# EAGLE design Analog_Schematic (EAGLE 9.5.2)
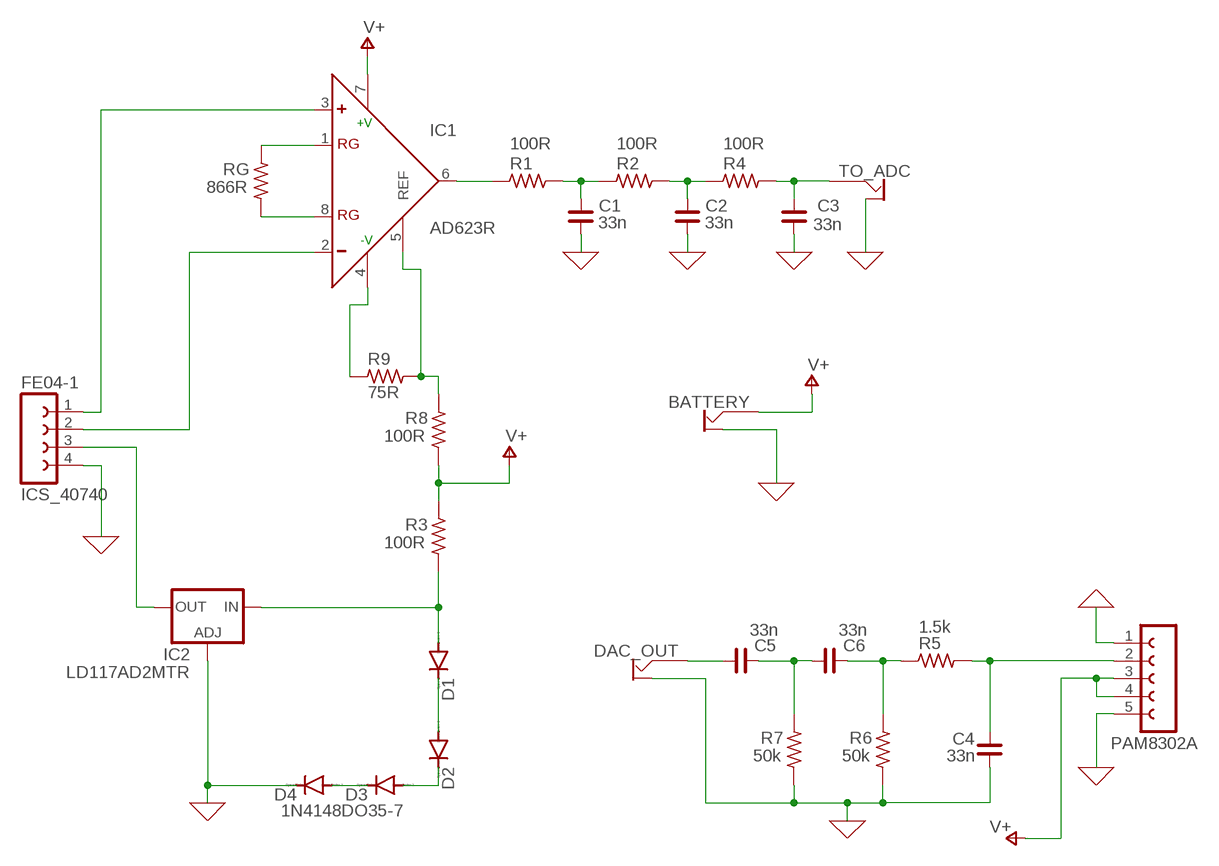
[diagram p0: schematic, sheet 1]

## Parts
BATTERY  OFFBOARD2JACKALT  [OFFBOARD2JACKALT]
C1  33n  C_0603  [C0603]
C2  33n  C_0603  [C0603]
C3  33n  C_0603  [C0603]
C4  33n  C_0603  [C0603]
C5  33n  C_0603  [C0603]
C6  33n  C_0603  [C0603]
D1  1N4148DO35-7  [DO35-7]
D2  1N4148DO35-7  [DO35-7]
D3  1N4148DO35-7  [DO35-7]
D4  1N4148DO35-7  [DO35-7]
DAC_OUT  OFFBOARD2JACKALT  [OFFBOARD2JACKALT]
IC1  AD623R  [SO8]
IC2  LD117AD2MTR  [D2PACK]
ICS_40740  FE04-1  [FE04-1]
PAM8302A  FE05-1  [FE05-1]
R1  100R  R_0603  [R0603]
R2  100R  R_0603  [R0603]
R3  100R  R_0603  [R0603]
R4  100R  R_0603  [R0603]
R5  1.5k  R_0603  [R0603]
R6  50k  R_0603  [R0603]
R7  50k  R_0603  [R0603]
R8  100R  R_0603  [R0603]
R9  75R  R_0603  [R0603]
RG  866R  R_0603  [R0603]
TO_ADC  OFFBOARD2JACKALT  [OFFBOARD2JACKALT]

## Nets
0: BATTERY.GND C1.2 C2.2 C3.2 C4.2 D4.C DAC_OUT.GND IC2.1(ADJ) ICS_40740.4 PAM8302A.1 PAM8302A.5 R6.1 R7.1 TO_ADC.GND ; supply symbol labelled GND
N$1: IC1.8(RG) RG.1
N$2: IC1.1(RG) RG.2
N$3: IC1.6(OUT) R1.1
N$4: IC1.4(-V) R9.1
N$5: IC1.5(REF) R8.2 R9.2
N$6: D1.A IC2.3(IN) R3.1
N$7: D1.C D2.A
N$8: D2.C D3.A
N$9: D3.C D4.A
N$11: IC2.2(OUT) ICS_40740.3
N$12: IC1.3(+) ICS_40740.1
N$13: IC1.2(-) ICS_40740.2
N$14: C1.1 R1.2 R2.1
N$15: C2.1 R2.2 R4.1
N$16: C3.1 R4.2 TO_ADC.SIGNAL
N$17: C5.1 DAC_OUT.SIGNAL
N$18: C5.2 C6.1 R7.2
N$19: C6.2 R5.1 R6.2
N$20: C4.1 PAM8302A.2 R5.2
V+: BATTERY.SIGNAL IC1.7(+V) PAM8302A.3 PAM8302A.4 R3.2 R8.1

## Library data of the parts
BATTERY DAC_OUT TO_ADC = aarons_library:OFFBOARD2JACKALT
C1-C6 = rc-master-smd:C_: NON-POLARIZED CAP
D1-D4 = diode:1N4148: DIODE high speed (Philips)
IC1 = analog-devices:AD623: Single-Supply, Rail-to-Rail, Low Cost Instrumentation Amplifier Source: http://www.analog.com/static/imported-files/data_sheets/AD623.pdf; MPN: AD623ARZ.; OC_FARNELL: 9426213; OC_NEWARK: 31M4186
IC2 = v-reg:LD117A?*: Low drop fixed and adjustable positive voltage regulators 1 A Source: http://www.st.com/stonline/products/literature/ds/7194/ld1117axx.pdf
ICS_40740 = LOCOBOCO_4pin:FE04-1
PAM8302A = LOCOBOCO_4pin:FE05-1: FEMALE HEADER; OC_FARNELL: unknown; OC_NEWARK: unknown
R1-R9 RG = rc-master-smd:R_: RESISTOR

## Board
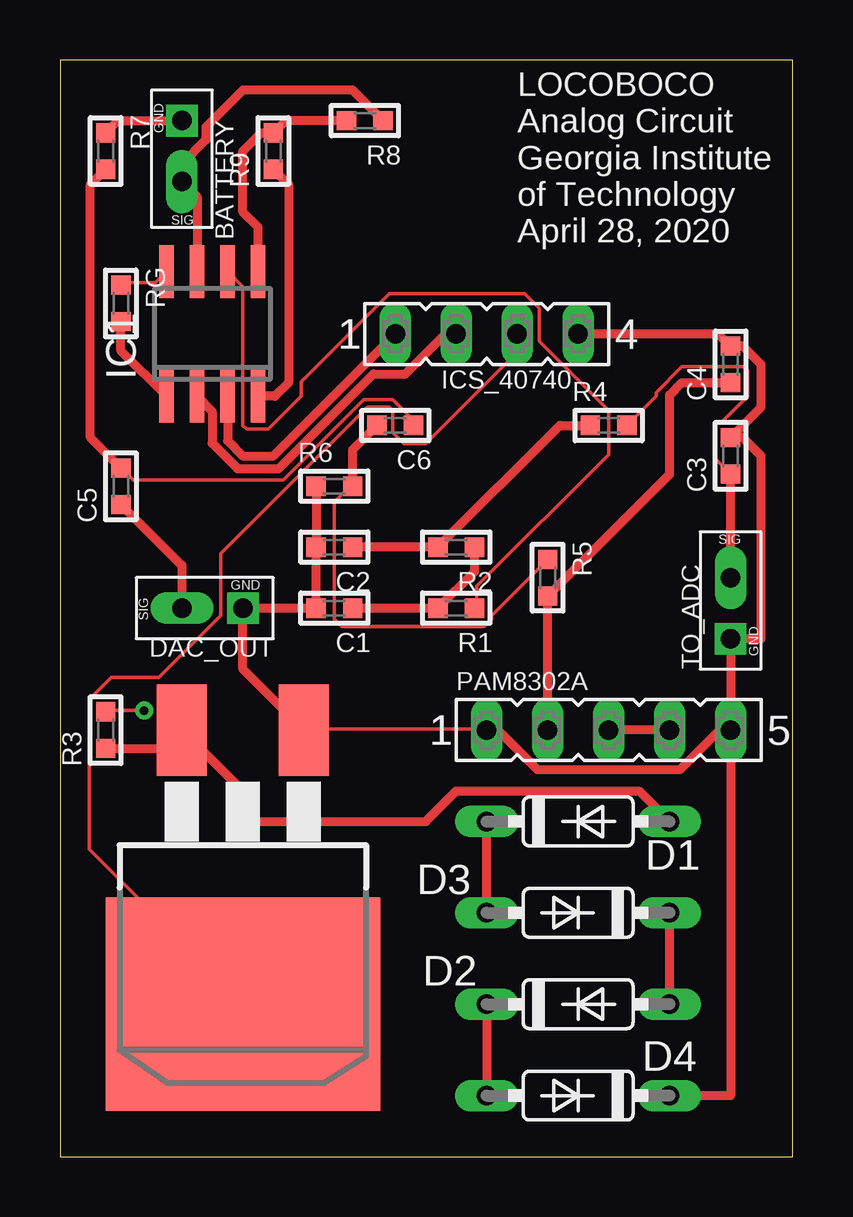
[diagram p1: board, top side]
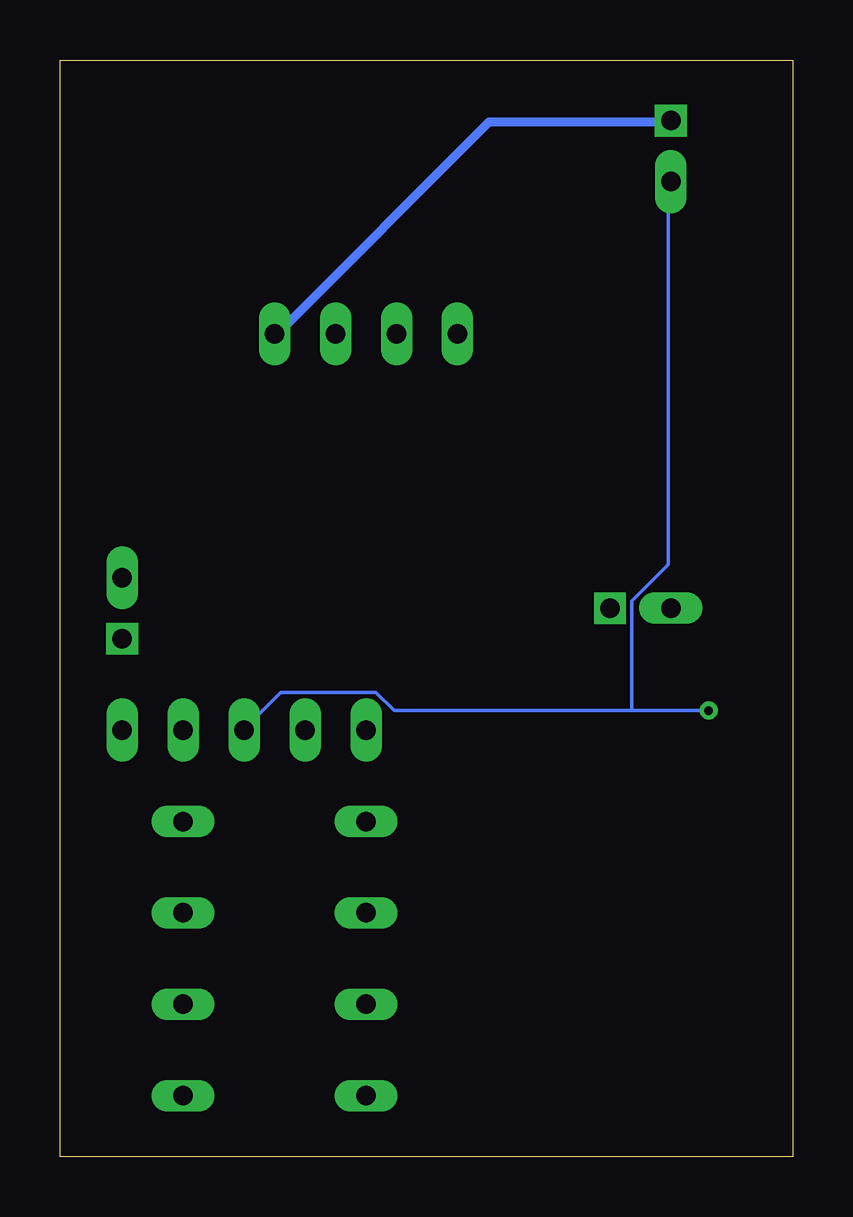
[diagram p2: board, bottom side, seen from below]

Size 30.53 x 45.71 mm. Coordinates in mm from the lower left corner, seen from the top.
Outline: 0,0 30.53,0 30.53,45.71 0,45.71 0,0
Copper layers (1*16): Top 0.035mm / dielectric 1.5mm / Bottom 0.035mm
Design rules "default": minimum track width 6mil, minimum drill 0.35mm, track to track 6mil, track to pad 6mil, pad to pad 6mil, via to via 6mil, smd to smd 6mil, copper to edge 40mil, drill to drill 6mil, minimum pad ring 10mil, minimum via ring 8mil, stop-mask expansion 4mil, vias tented up to drill 0mil, thermal gap 10mil

### Footprints (pad centres in the part's own frame; a part is rotated, then mirrored left to right if it is on the bottom)
OFFBOARD2JACKALT = drill 0.813 square: GND -1.27,-1.27 | drill 0.813 long: SIGNAL -1.27,1.27
C0603 = smd 0.8 x 0.8: 1 -0.762,0; 2 0.762,0
DO35-7 = drill 0.813 long: A 3.81,0; C -3.81,0
SO8 = smd 0.6 x 2.2: 1 -1.905,-2.6; 2 -0.635,-2.6; 3 0.635,-2.6; 4 1.905,-2.6; 5 1.905,2.6; 6 0.635,2.6; 7 -0.635,2.6; 8 -1.905,2.6
D2PACK = smd 2.083 x 3.81: 1 -2.54,-8.89; 3 2.54,-8.89 | smd 11.43 x 8.89: 2 0,2.54
FE04-1 = drill 0.813 long: 1 -5.08,0; 2 -2.54,0; 3 0,0; 4 2.54,0
FE05-1 = drill 0.813 long: 1 -5.08,0; 2 -2.54,0; 3 0,0; 4 2.54,0; 5 5.08,0
R0603 = smd 0.8 x 0.8: 1 -0.762,0; 2 0.762,0

### Placement (x,y rotation side)
BATTERY  3.81,41.91 180 top
C1  11.43,22.86 180 top
C2  11.43,25.4 180 top
C3  27.94,29.21 90 top
C4  27.94,33.02 90 top
C5  2.54,27.94 90 top
C6  13.97,30.48 180 top
D1  21.59,13.97 0 top
D2  21.59,10.16 180 top
D3  21.59,6.35 0 top
D4  21.59,2.54 180 top
DAC_OUT  6.35,24.13 90 top
IC1  6.35,34.29 0 top
IC2  7.62,8.89 180 top
ICS_40740  19.05,34.29 0 top
PAM8302A  22.86,17.78 0 top
R1  16.51,22.86 180 top
R2  16.51,25.4 180 top
R3  1.91,17.78 90 top
R4  22.86,30.48 0 top
R5  20.32,24.13 270 top
R6  11.43,27.94 0 top
R7  1.91,41.91 270 top
R8  12.7,43.18 180 top
R9  8.89,41.91 90 top
RG  2.54,35.56 270 top
TO_ADC  29.21,22.86 0 top

### Tracks (layer width: path | path; a pad name or v marks a point on that pad's centre or on a via)
0
  Top 0.152: IC2.1 10.21,17.83 17.68,17.83 PAM8302A.1
  Top 0.381: D4.C 27.94,2.54 PAM8302A.5 | PAM8302A.5 TO_ADC.GND 29.21,21.59 29.21,29.21 28.45,29.97 C3.2 29.21,31.24 29.21,33.02 28.45,33.78 C4.2 27.43,34.29 ICS_40740.4 | R7.1 2.41,43.18 BATTERY.GND | IC2.1 7.62,20.32 DAC_OUT.GND C1.2 C2.2 R6.1 | PAM8302A.5 27.48,17.78 25.82,16.12 19.9,16.12 18.24,17.78 PAM8302A.1
  Bottom 0.152: 5.18,43.13 BATTERY.GND | 21.49,34.29 ICS_40740.4
  Bottom 0.381: 5.18,43.13 12.65,43.13 21.49,34.29
N$1
  Top 0.152: RG.1 2.59,36.42 3.96,36.42 4.42,36.88 IC1.8
N$2
  Top 0.381: IC1.1 2.54,33.59 RG.2
N$3
  Top 0.152: R1.1 17.37,22.86 17.37,23.77 22.86,29.26 22.86,31.09 19.96,33.98 19.96,35.36 19.36,35.97 13.72,35.97 10.06,32.31 10.06,31.7 8.69,30.33 7.77,30.33 7.62,30.48 7.62,36.27 7.01,36.88 IC1.6
N$4
  Top 0.381: R9.1 9.53,40.51 9.53,32.26 8.96,31.69 IC1.4
N$5
  Top 0.381: R8.2 9.4,43.18 R9.2 8.38,42.67 7.62,41.91 7.62,39.37 8.26,38.73 IC1.5
N$6
  Top 0.381: R3.1 4.32,17.02 IC2.3 7.62,15.24 7.62,13.97 15.24,13.97 16.51,15.24 24.13,15.24 D1.A
N$7
  Top 0.381: D2.A D1.C
N$8
  Top 0.381: D3.A D2.C
N$9
  Top 0.381: D3.C D4.A
N$11
  Top 0.152: ICS_40740.3 19.05,33.53 15.24,29.72 14.33,29.72 13.87,30.18 13.87,31.09 13.72,31.24 12.8,31.24 6.71,25.15 6.71,22.55 4.12,19.96 2.13,19.96 1.22,19.05 1.22,12.8 7.62,6.4 IC2.2
N$12
  Top 0.381: IC1.3 6.99,29.84 7.62,29.21 8.89,29.21 ICS_40740.1
N$13
  Top 0.381: IC1.2 6.34,31.06 6.34,29.73 7.4,28.68 9.11,28.68 13.06,32.63 14.39,32.63 16.05,34.29 ICS_40740.2
N$14
  Top 0.381: C1.1 R1.2 17.27,24.38 R2.1
N$15
  Top 0.381: C2.1 R2.2 20.83,30.48 R4.1
N$16
  Top 0.152: R4.2 24.84,31.7 24.84,31.85 25.91,32.92 28.5,32.92 28.65,32.77 28.65,31.7 27.58,30.63 27.43,30.63 27.28,30.48 27.28,29.11 C3.1
  Top 0.381: TO_ADC.SIGNAL C3.1
N$17
  Top 0.381: C5.1 5.08,24.64 DAC_OUT.SIGNAL
N$18
  Top 0.152: C5.2 3.05,28.19 9.3,28.19 12.65,31.55 13.87,31.55 14.63,30.79 14.63,30.48 C6.1
  Top 0.381: C5.2 1.27,29.97 1.27,40.51 R7.2
N$19
  Top 0.152: R5.1 17.98,22.55 17.98,22.4 17.68,22.1 11.73,22.1 11.43,22.4 11.43,27.28 12.04,27.89 R6.2
  Top 0.381: R6.2 12.19,29.46 C6.2
N$20
  Top 0.381: PAM8302A.2 R5.2 25.4,28.45 25.4,31.75 25.91,32.26 C4.1
V+  (via drill 0.35)
  Top 0.152: v3.5,18.59 1.98,18.59 R3.2
  Top 0.381: PAM8302A.4 PAM8302A.3 | IC1.7 5.71,40.01 BATTERY.SIGNAL 5.08,41.37 6.08,42.38 6.08,42.91 7.62,44.45 12.19,44.45 R8.1
  Bottom 0.152: 6.71,18.59 16.61,18.59 17.37,19.36 21.34,19.36 22.86,17.83 PAM8302A.3 | 6.71,18.59 v3.5,18.59 | 6.71,18.59 6.71,23.16 5.18,24.69 5.18,40.54 BATTERY.SIGNAL

### Text on the board
tNames: LOCOBOCO / Analog Circuit / Georgia Institute / of Technology / April 28, 2020